# EAGLE schematic eightByEight (EAGLE 7.5.0)
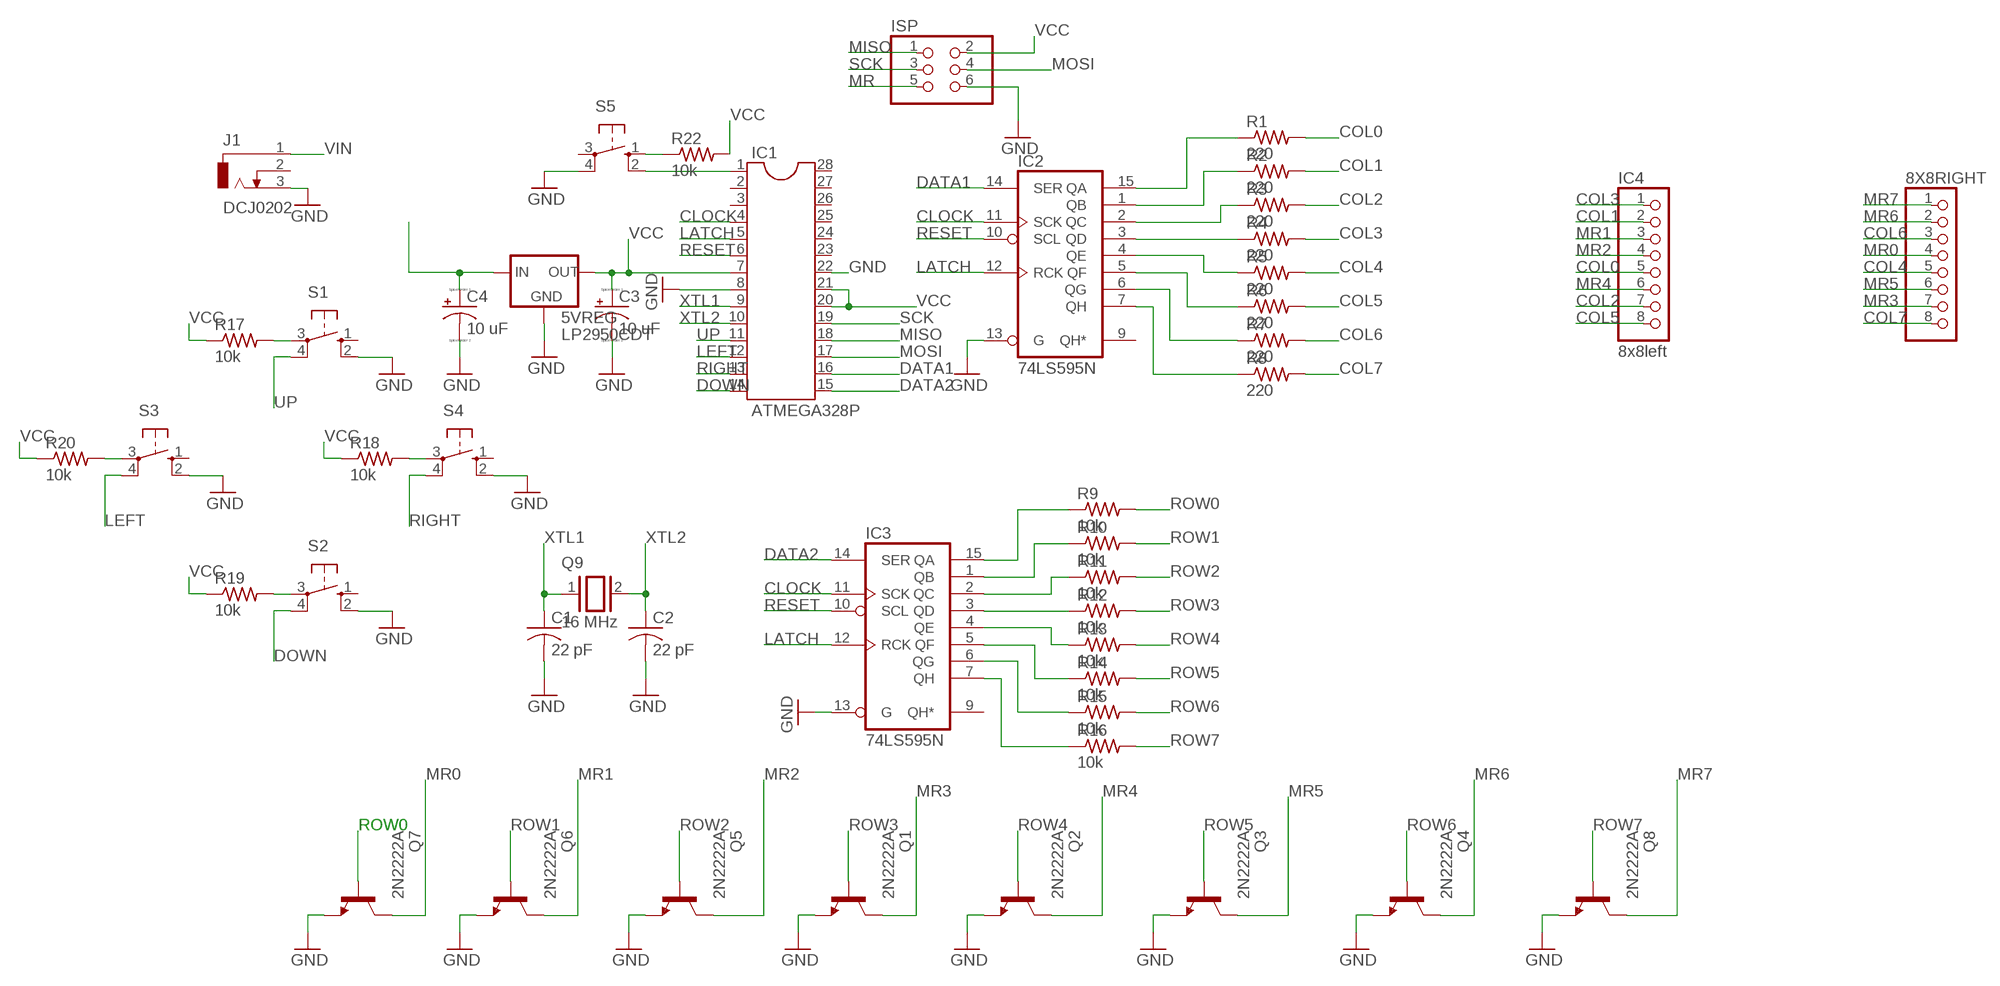
[diagram p0: schematic, sheet 1]

## Parts
5VREG  LP2950CDT  LP2950CDT-5.0  [DPACK]
8X8RIGHT  PINHD-1X8  [1X08]
C1  22 pF  C-USC0805  [C0805]
C2  22 pF  C-USC0805  [C0805]
C3  10 uF  CPOL-USTT2D5  [TT2D5]
C4  10 uF  CPOL-USTT2D5  [TT2D5]
IC1  ATMEGA328P  DIL28-4  [DIL28-4]
IC2  74LS595N  [DIL16]
IC3  74LS595N  [DIL16]
IC4  8x8left  PINHD-1X8  [1X08]
ISP  PINHD-2X3  [2X03]
J1  DCJ0202  [DCJ0202]
Q1  2N2222A  [TO18]
Q2  2N2222A  [TO18]
Q3  2N2222A  [TO18]
Q4  2N2222A  [TO18]
Q5  2N2222A  [TO18]
Q6  2N2222A  [TO18]
Q7  2N2222A  [TO18]
Q8  2N2222A  [TO18]
Q9  16 MHz  XTAL/S  [QS]
R1  220  R-US_M0805  [M0805]
R2  220  R-US_M0805  [M0805]
R3  220  R-US_M0805  [M0805]
R4  220  R-US_M0805  [M0805]
R5  220  R-US_M0805  [M0805]
R6  220  R-US_M0805  [M0805]
R7  220  R-US_M0805  [M0805]
R8  220  R-US_M0805  [M0805]
R9  10k  R-US_M0805  [M0805]
R10  10k  R-US_M0805  [M0805]
R11  10k  R-US_M0805  [M0805]
R12  10k  R-US_M0805  [M0805]
R13  10k  R-US_M0805  [M0805]
R14  10k  R-US_M0805  [M0805]
R15  10k  R-US_M0805  [M0805]
R16  10k  R-US_M0805  [M0805]
R17  10k  R-US_M0805  [M0805]
R18  10k  R-US_M0805  [M0805]
R19  10k  R-US_M0805  [M0805]
R20  10k  R-US_M0805  [M0805]
R22  10k  R-US_M0805  [M0805]
S1  10-XX  [B3F-10XX]
S2  10-XX  [B3F-10XX]
S3  10-XX  [B3F-10XX]
S4  10-XX  [B3F-10XX]
S5  10-XX  [B3F-10XX]

## Nets
CLOCK: IC1.4 IC2.11(SCK) IC3.11(SCK)
COL0: IC4.5 R1.2
COL1: IC4.2 R2.2
COL2: IC4.7 R3.2
COL3: IC4.1 R4.2
COL4: 8X8RIGHT.5 R5.2
COL5: IC4.8 R6.2
COL6: 8X8RIGHT.3 R7.2
COL7: 8X8RIGHT.8 R8.2
DATA1: IC1.16 IC2.14(SER)
DATA2: IC1.15 IC3.14(SER)
DOWN: IC1.14 S2.4(P1)
GND: 5VREG.4(GND) C1.2 C2.2 C3.- C4.- IC1.8 IC1.22 IC2.13(G) IC3.13(G) ISP.6 J1.3 Q1.1(E) Q2.1(E) Q3.1(E) Q4.1(E) Q5.1(E) Q6.1(E) Q7.1(E) Q8.1(E) S1.2(S1) S2.2(S1) S3.2(S1) S4.2(S1) S5.4(P1)
LATCH: IC1.5 IC2.12(RCK) IC3.12(RCK)
LEFT: IC1.12 S3.4(P1)
MISO: IC1.18 ISP.1
MOSI: IC1.17 ISP.4
MR: IC1.1 ISP.5 S5.2(S1)
MR0: 8X8RIGHT.4 Q7.3(C)
MR1: IC4.3 Q6.3(C)
MR2: IC4.4 Q5.3(C)
MR3: 8X8RIGHT.7 Q1.3(C)
MR4: IC4.6 Q2.3(C)
MR5: 8X8RIGHT.6 Q3.3(C)
MR6: 8X8RIGHT.2 Q4.3(C)
MR7: 8X8RIGHT.1 Q8.3(C)
N$2: R22.1 S5.1(S)
N$4: R20.2 S3.3(P)
N$5: R17.2 S1.3(P)
N$6: R18.2 S4.3(P)
N$7: IC2.7(QH) R8.1
N$8: IC2.6(QG) R7.1
N$9: IC2.5(QF) R6.1
N$10: IC2.4(QE) R5.1
N$11: R19.2 S2.3(P)
N$12: IC2.3(QD) R4.1
N$13: IC2.2(QC) R3.1
N$14: IC2.1(QB) R2.1
N$15: IC2.15(QA) R1.1
N$16: IC3.7(QH) R16.1
N$17: IC3.6(QG) R15.1
N$18: IC3.5(QF) R14.1
N$19: IC3.4(QE) R13.1
N$20: IC3.3(QD) R12.1
N$21: IC3.2(QC) R11.1
N$22: IC3.1(QB) R10.1
N$23: IC3.15(QA) R9.1
RESET: IC1.6 IC2.10(SCL) IC3.10(SCL)
RIGHT: IC1.13 S4.4(P1)
ROW0: Q7.2(B) R9.2
ROW1: Q6.2(B) R10.2
ROW2: Q5.2(B) R11.2
ROW3: Q1.2(B) R12.2
ROW4: Q2.2(B) R13.2
ROW5: Q3.2(B) R14.2
ROW6: Q4.2(B) R15.2
ROW7: Q8.2(B) R16.2
SCK: IC1.19 ISP.3
UP: IC1.11 S1.4(P1)
VCC: 5VREG.3(OUT) C3.+ IC1.7 IC1.20 IC1.21 ISP.2 R17.1 R18.1 R19.1 R20.1 R22.2
VIN: 5VREG.1(IN) C4.+ J1.1
XTL1: C1.1 IC1.9 Q9.1
XTL2: C2.1 IC1.10 Q9.2
Unconnected: IC1.2 IC1.3 IC1.23 IC1.24 IC1.25 IC1.26 IC1.27 IC1.28 IC2.9(QH*) IC3.9(QH*) J1.2 S1.1(S) S2.1(S) S3.1(S) S4.1(S) S5.3(P)

## Power pins joined to a net without a drawn wire
GND: IC2.8(GND) IC3.8(GND)
VCC: IC2.16(VCC) IC3.16(VCC)

## Library data of the parts
5VREG = v-reg:LP2950?*: Source: http://cache.national.com/ds/LP/LP2950.pdf
8X8RIGHT IC4 = pinhead:PINHD-1X8: PIN HEADER
C1 C2 = resistor:C-US: CAPACITOR, American symbol
C3 C4 = resistor:CPOL-US: POLARIZED CAPACITOR, American symbol
IC1 = ic-package:DIL28: Dual In Line
IC2 IC3 = 74xx-us:74*595: 8-bit SHIFT REGISTER, output latch
ISP = pinhead:PINHD-2X3: PIN HEADER
J1 = con-jack:DCJ0202: DC POWER JACK Source: DCJ0202.pdf; OC_FARNELL: unknown; OC_NEWARK: unknown
Q1-Q8 = transistor-npn:2N2222*: NPN Transistor
Q9 = special:XTAL/S: CRYSTAL
R1-R20 R22 = resistor:R-US_: RESISTOR, American symbol
S1-S5 = switch-omron:10-XX: OMRON SWITCH; MPN: B3F-1000; OC_FARNELL: 176432; OC_NEWARK: 36M3542